# Altium schematic sheet BEESP_CODE_mpu.SchDoc
size A4
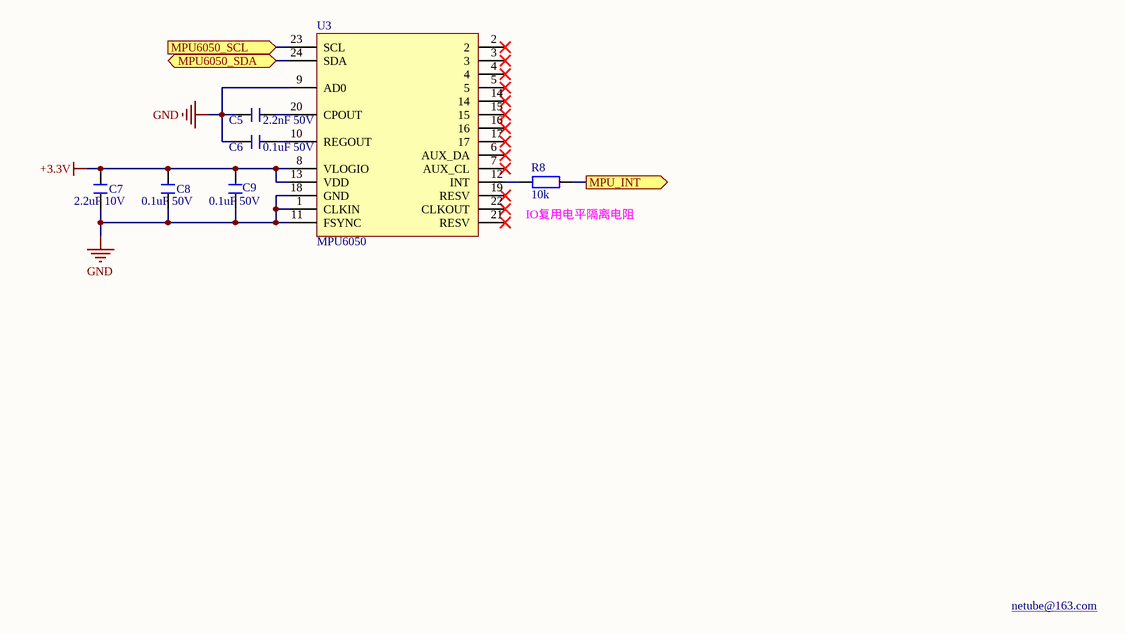
[diagram p0: BEESP_CODE_mpu.SchDoc]

## Parts
C5  2.2nF 50V  [C 0402_L]
C6  0.1uF 50V  [C 0402_L]
C7  2.2uF 10V  [C 0402_L]
C8  0.1uF 50V  [C 0402_L]
C9  0.1uF 50V  [C 0402_L]
R8  10k  [R 0402_L]
U3  MPU6050  [QFN24 4x4_NOPAD]

## Ports
MPU6050_SCL (in), MPU6050_SDA (bidir), MPU_INT (out)

## Nets
+3.3V: C7.1 C8.1 C9.1 U3.8(VLOGIO) U3.13(VDD)
GND: C5.1 C6.1 C7.2 C8.2 C9.2 U3.1(CLKIN) U3.9(AD0) U3.11(FSYNC) U3.18(GND)
MPU6050_SCL: U3.23(SCL) ; port MPU6050_SCL
MPU6050_SDA: U3.24(SDA) ; port MPU6050_SDA
MPU_INT: R8.1 ; port MPU_INT
NetC5_2: C5.2 U3.20(CPOUT)
NetC6_2: C6.2 U3.10(REGOUT)
NetR8_2: R8.2 U3.12(INT)

Not connected (* = marked no-connect by the designer): U3 2* 3* 4* 5* 6(AUX_DA)* 7(AUX_CL)* 14* 15* 16* 17* 19(RESV)* 21(RESV)* 22(CLKOUT)*

## Notes on the sheet
- (near R8) IO复用电平隔离电阻
- netube@163.com

## Library data of the parts
C5-C9 = C: 贴片电容; BOM名称: 无极性贴片电容; 优秀评价可免费更新: 联系淘宝ID：黄晶宝石，获取更新版封装库; 卖家免费技术支持，联系售后: 唯一出售店铺网址https://shop463601444.taobao.com; 本封装库来自淘宝卖家 ID：黄晶宝石: 其他店铺购入均为盗版，请立即申请退款
R8 = R: 贴片电阻; 优秀评价可免费更新: 联系淘宝ID：黄晶宝石，获取更新版封装库; 卖家免费技术支持，联系售后: 唯一出售店铺网址https://shop463601444.taobao.com; 本封装库来自淘宝卖家 ID：黄晶宝石: 其他店铺购入均为盗版，请立即申请退款; BOM名称: 贴片电阻
U3 = MPU6050: 三轴加速度+三轴陀螺仪; 优秀评价可免费更新: 联系淘宝ID：黄晶宝石，获取更新版封装库; 卖家免费技术支持，联系售后: 唯一出售店铺网址https://shop463601444.taobao.com; 封装库来自淘宝卖家ID：黄晶宝石: 其他店铺购入均为假冒，请立即申请退款，本店奖励2~5元现金